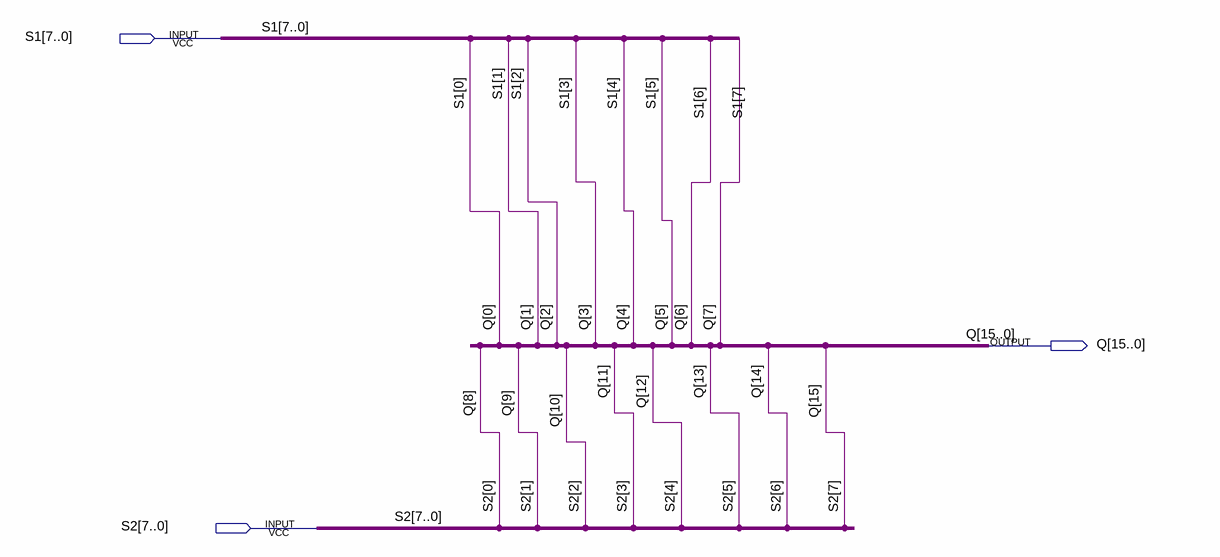
[diagram p0: schematic sheet]
// Quartus schematic concat_8_16.bdf as structural Verilog: 0 symbols, 3 pins
module concat_8_16 (
  input  [7:0] S1,
  input  [7:0] S2,
  output [15:0] Q
);


  assign Q = {S2, S1};
endmodule
